# EAGLE design V4-AddOnZigbee-DIL-V02-004 (EAGLE 7.7.0)
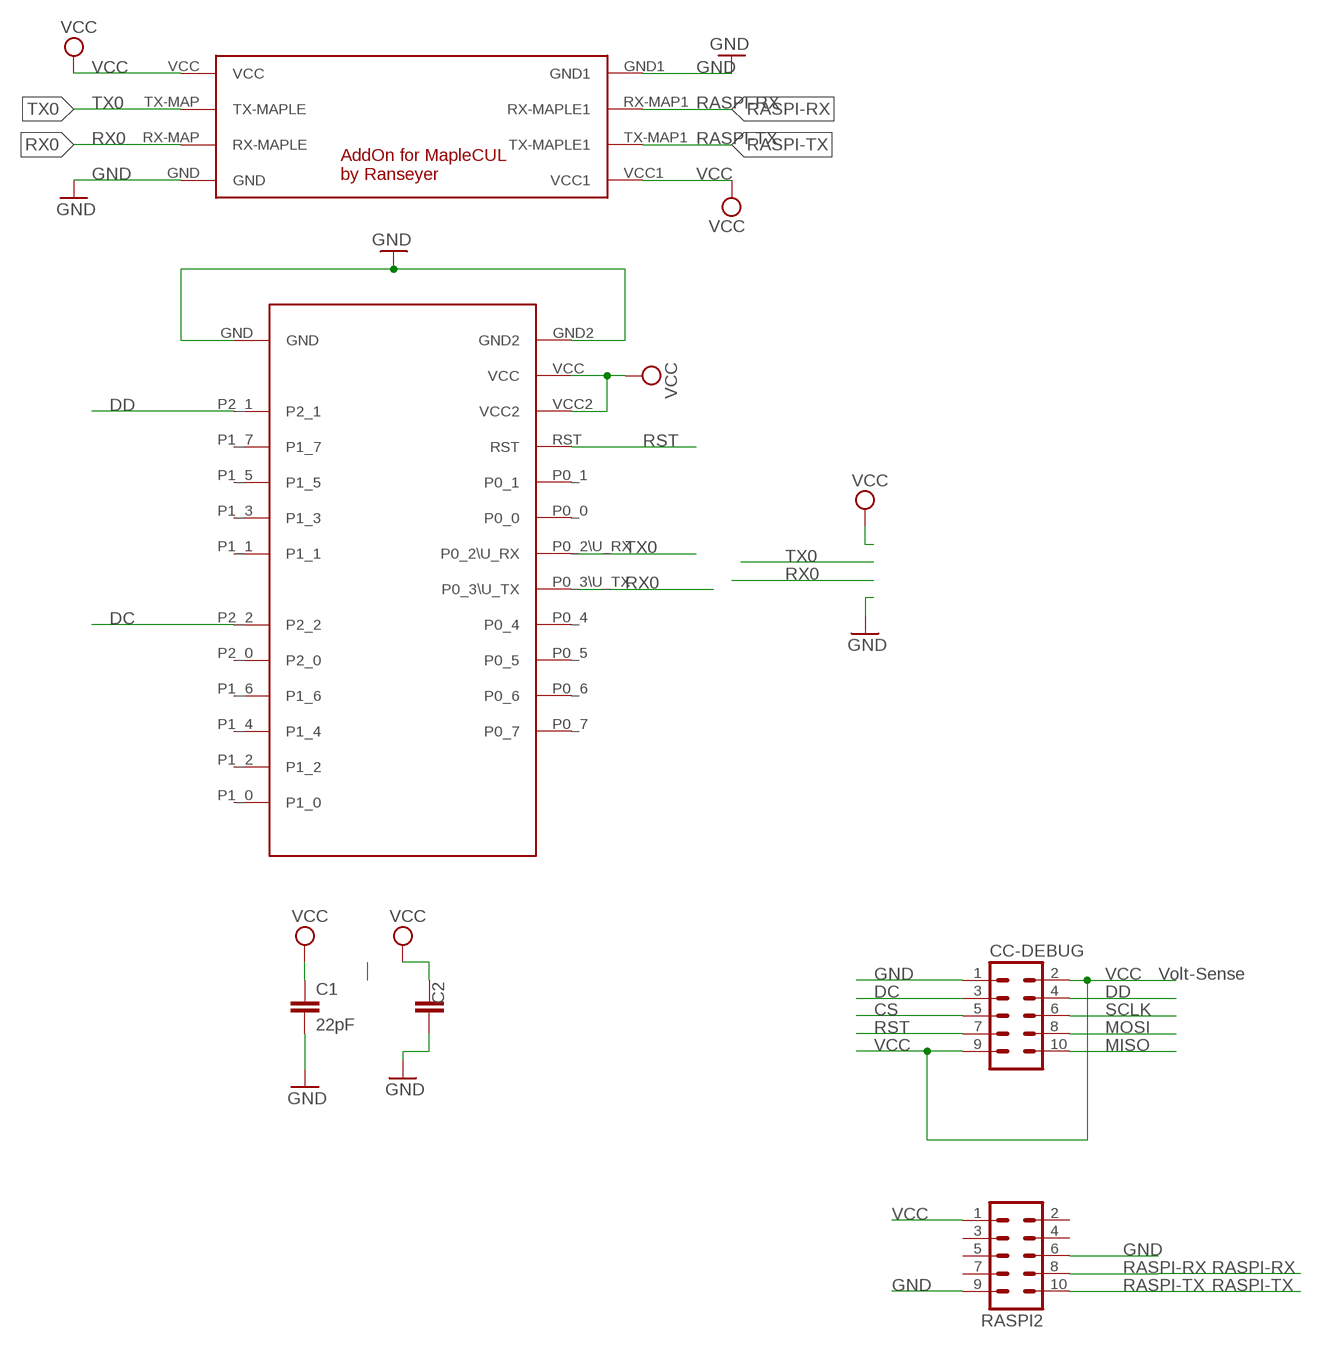
[diagram p0: schematic, sheet 1]

## Parts
C1  22pF  C-EUC0805  [C0805]
C2  C-EUC1812  [C1812]
CC-DEBUG  CONN_05X2SHD_LOCK  [2X5-SHROUDED_LOCK]
RASPI2  MA05-2  [MA05-2]
U$1  MAPLE-CUL-ADDON-V01  [MAPLE-CUL-V01]
U$3  CC2530_MODULE  [CC2530_DIL]

## Nets
CS: CC-DEBUG.5
DC: CC-DEBUG.3 U$3.P2_2
DD: CC-DEBUG.4 U$3.P2_1
GND [PWR]: C1.2 C2.1 CC-DEBUG.1 RASPI2.6 RASPI2.9 U$1.GND U$1.GND1 U$3.GND U$3.GND2
MISO: CC-DEBUG.10
MOSI: CC-DEBUG.8
RASPI-RX: RASPI2.8 U$1.RX-MAP1(RX-MAPLE1)
RASPI-TX: RASPI2.10 U$1.TX-MAP1(TX-MAPLE1)
RST: CC-DEBUG.7 U$3.RST
RX0: U$1.RX-MAP(RX-MAPLE) U$3.P0_3\U_TX
SCLK: CC-DEBUG.6
TX0: U$1.TX-MAP(TX-MAPLE) U$3.P0_2\U_RX
VCC [PWR]: C1.1 C2.2 CC-DEBUG.2 CC-DEBUG.9 RASPI2.1 U$1.VCC U$1.VCC1 U$3.VCC U$3.VCC2
Unconnected: RASPI2.2 RASPI2.3 RASPI2.4 RASPI2.5 RASPI2.7 U$3.P0_0 U$3.P0_1 U$3.P0_4 U$3.P0_5 U$3.P0_6 U$3.P0_7 U$3.P1_0 U$3.P1_1 U$3.P1_2 U$3.P1_3 U$3.P1_4 U$3.P1_5 U$3.P1_6 U$3.P1_7 U$3.P2_0

## Notes on the sheet
- Volt-Sense

## Library data of the parts
C1 C2 = rcl:C-EU: CAPACITOR, European symbol; SPICEPREFIX: C
CC-DEBUG = SparkFun-Connectors:CONN_05X2: Multi connection point. Often used as Generic Header-pin footprint for 0.1 inch spaced/style header connections For AVR SPI programming port, see special device with nice symbol: "AVR_SPI_PROG_5x2.dev" You can populate with any combo of single row headers, but if you'd like an exact match, check these: 2x5 AVR ICSP Male Header <https://www.sparkfun.com/products/778> (PRT-00778) 2x5 Pin Shrouded Header <https://www.sparkfun.com/products/8506> (PRT-08506) On any of the 0.1 inch spaced packages, you can populate with these: Break Away Headers - Straight <https://www.sparkfun.com/products/116> (PRT-00116) Break Away Male Headers - Right Angle <https://www.sparkfun.com/products/553> (PRT-00553) Female Headers <https://www.sparkfun.com/products/115> (PRT-00115) Break Away Headers - Machine Pin <https://www.sparkfun.com/products/117> (PRT-00117) Break Away Female Headers - Swiss Machine Pin <https://www.sparkfun.com/products/743> (PRT-00743) Special note: the shrouded connector mates well with our 5x2 ribbon cables: 2x5 Pin IDC Ribbon Cable <https://www.sparkfun.com/products/8535> (PRT-08535); PROD_ID: CONN-08671; SF_ID: PRT-08506
RASPI2 = con-lstb:MA05-2: PIN HEADER; OC_FARNELL: unknown; OC_NEWARK: unknown
U$1 = Martin-Communication-V4:MAPLE-CUL-ADDON-V01: AddOn for MAPLE-CUL V4.x
U$3 = Martin-Communication-V4:CC2530_MODULE

## Net classes
0 default: width 0.356 mm
1 PWR: width 0.559 mm

## Board
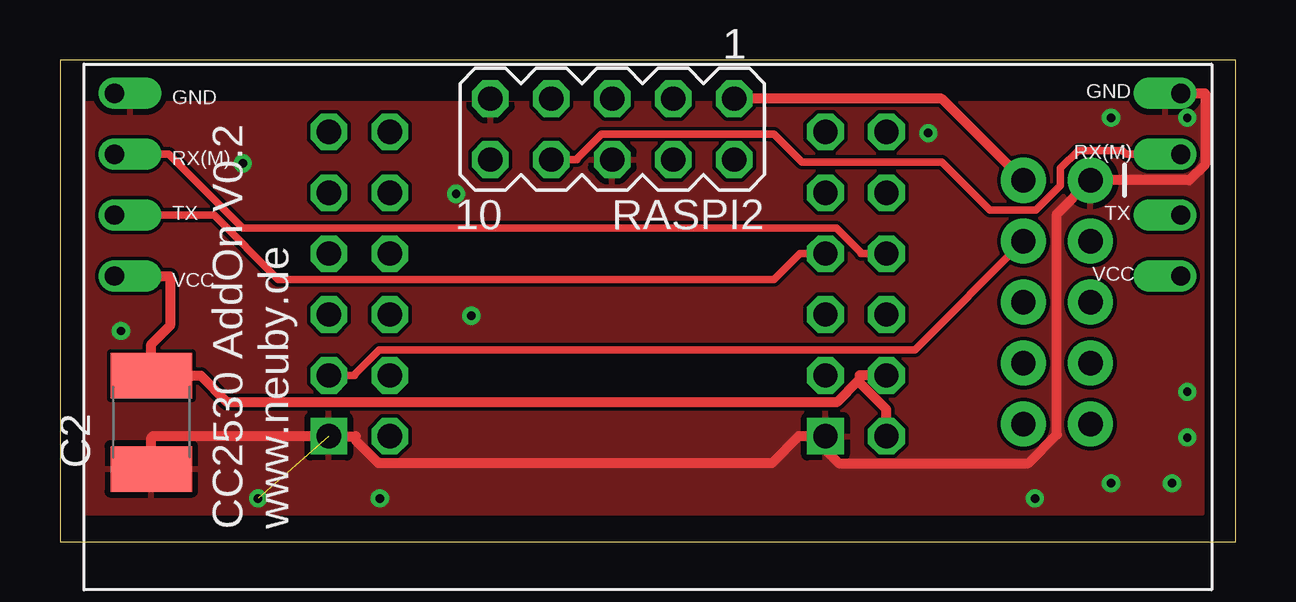
[diagram p1: board, top side]
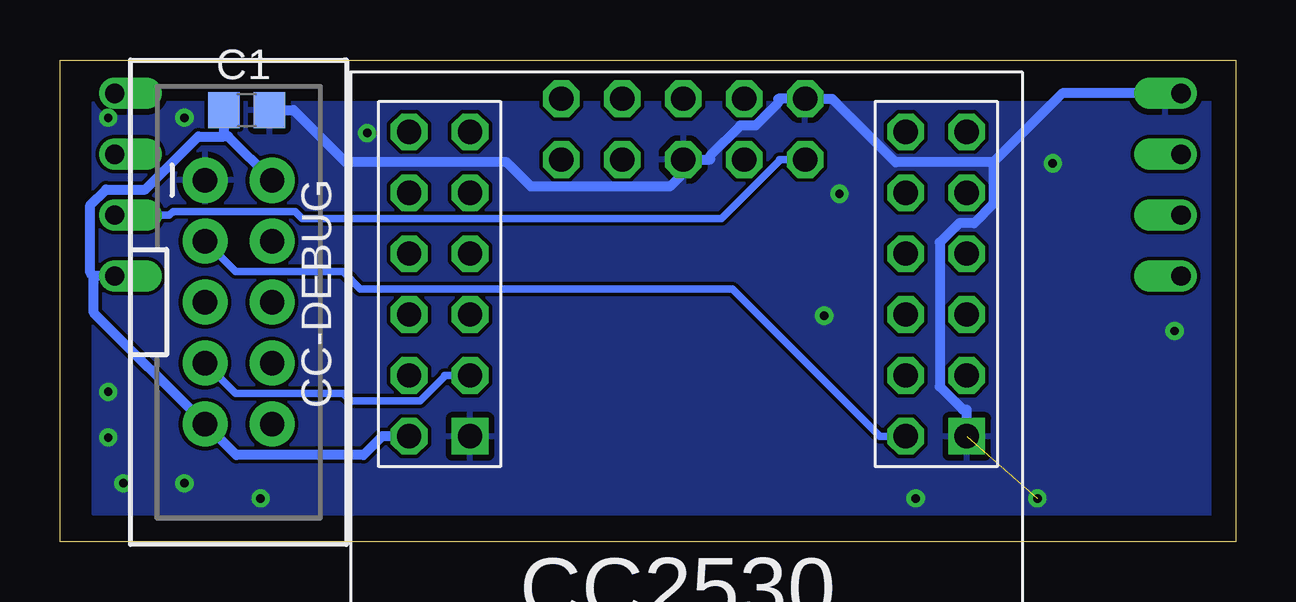
[diagram p2: board, bottom side, seen from below]

Size 49 x 20.09 mm. Coordinates in mm from the lower left corner, seen from the top.
Outline: 0,0 49,0 49,20.09 0,20.09 0,0
Copper layers (1*16): Top 0.035mm / dielectric 1.5mm / Bottom 0.035mm
Design rules "default": minimum track width 6mil, minimum drill 0.35mm, track to track 6mil, track to pad 6mil, pad to pad 6mil, via to via 6mil, smd to smd 6mil, copper to edge 40mil, drill to drill 6mil, minimum pad ring 10mil, minimum via ring 8mil, stop-mask expansion 4mil, vias tented up to drill 0mil, thermal gap 10mil

### Footprints (pad centres in the part's own frame; a part is rotated, then mirrored left to right if it is on the bottom)
C0805 = smd 1.3 x 1.5: 1 -0.95,0; 2 0.95,0
C1812 = smd 1.9 x 3.4: 1 -1.95,0; 2 1.95,0
2X5-SHROUDED_LOCK = drill 1.016 pad 1.88: 1 -1.397,5.08; 2 1.397,5.08; 3 -1.397,2.54; 4 1.397,2.54; 5 -1.397,0; 6 1.397,0; 7 -1.397,-2.54; 8 1.397,-2.54; 9 -1.397,-5.08; 10 1.397,-5.08
MA05-2 = drill 1.016 octagon: 1 -5.08,-1.27; 2 -5.08,1.27; 3 -2.54,-1.27; 4 -2.54,1.27; 5 0,-1.27; 6 0,1.27; 7 2.54,-1.27; 8 2.54,1.27; 9 5.08,-1.27; 10 5.08,1.27
MAPLE-CUL-V01 = drill 0.8 offset: GND 1.27,12.7; GND1 45.72,12.7; RX-MAP 1.27,10.16; RX-MAP1 45.72,10.16; TX-MAP 1.27,7.62; TX-MAP1 45.72,7.62; VCC 1.27,5.08; VCC1 45.72,5.08
CC2530_DIL = drill 1.016 square: GND 2.316,15.19; GND2 23.017,15.19 | drill 1.016 octagon: P0_0 23.017,10.11; P0_1 25.557,10.11; P0_2\U_RX 23.017,7.57; P0_3\U_TX 25.557,7.57; P0_4 23.017,5.03; P0_5 25.557,5.03; P0_6 23.017,2.49; P0_7 25.557,2.49; P1_0 4.856,2.49; P1_1 2.316,2.49; P1_2 4.856,5.03; P1_3 2.316,5.03; P1_4 4.856,7.57; P1_5 2.316,7.57; P1_6 4.856,10.11; P1_7 2.316,10.11; P2_0 4.856,12.65; P2_1 2.316,12.65; P2_2 4.856,15.19; RST 23.017,12.65; VCC 25.557,15.19; VCC2 25.557,12.65

### Placement (x,y rotation side)
C1  41.22,18 0 bottom
C2  3.81,4.99 90 top
CC-DEBUG  41.55,9.99 0 bottom
RASPI2  23.02,17.21 180 top
U$1  1,6 0 top
U$3  8.89,19.59 180 bottom

### Tracks (layer width: path | path; a pad name or v marks a point on that pad's centre or on a via)
DC
  Bottom 0.305: U$3.P2_2 14.81,4.4 20.96,10.55 36.49,10.55 37.21,11.27 41.68,11.27 CC-DEBUG.3
DD
  Top 0.305: U$3.P2_1 12.27,6.94 12.27,6.98 13.3,8.01 35.63,8.01 CC-DEBUG.4
GND  (via drill 0.35)  (1 unrouted)
  Top 0.406: 31.35,4.4 32.47,3.28 40.36,3.28 41.55,4.48 41.55,13.68 CC-DEBUG.1 47.06,15.07 47.73,15.74 47.73,18.7 U$1.GND1 | 31.35,4.4 30.79,4.4 29.67,3.28 13.28,3.28 12.32,4.23 12.32,4.4 U$3.GND 3.87,4.4 3.81,4.34 C2.1 | U$3.GND2 31.35,4.4
  Bottom 0.406: 10.09,15.83 14.17,15.83 16.82,18.48 RASPI2.9 19.06,18.48 19.06,18.31 20.01,17.36 20.64,17.36 21.9,16.1 21.9,15.94 22.46,15.94 | U$1.GND 7.22,18.7 10.09,15.83 | 10.09,15.83 10.09,14.1 10.89,13.29 11.52,13.29 12.33,12.48 12.33,6.47 11.37,5.52 11.21,5.52 U$3.GND | C1.2 39.26,18 37.09,15.83 30.38,15.83 29.37,14.82 23.58,14.82 22.46,15.94 | RASPI2.6 22.46,15.94
  other vias: 8.26,1.81 2.54,8.79 7.62,15.78 16.51,14.51 17.14,9.43 13.34,1.81 46.35,2.45 43.81,2.45 40.64,1.81 46.99,4.35 46.99,6.26 46.99,17.68 43.81,17.68 36.2,17.05
  pour Top: 0.64,18.32 47.62,18.32 47.62,1.17 0.64,1.17
  pour Bottom: 0.64,18.32 46.99,18.32 47.62,18.32 47.62,1.17 0.64,1.17
RASPI-RX
  Top 0.305: RASPI2.8 21.55,15.94 21.55,15.98 22.58,17.01 29.75,17.01 30.93,15.83 36.77,15.83 38.77,13.83 40.67,13.83 41.71,14.86 41.71,15.59 42.44,16.32 44.29,16.32 44.45,16.16 U$1.RX-MAP1
RASPI-TX
  Bottom 0.305: RASPI2.10 19.01,15.94 19.01,15.9 21.42,13.49 38.91,13.49 39.2,13.78 44.29,13.78 44.45,13.62 U$1.TX-MAP1
RST
  Bottom 0.305: U$3.RST 32.97,6.94 32.97,6.9 34,5.87 36.89,5.87 37.21,6.19 41.68,6.19 CC-DEBUG.7
RX0
  Top 0.305: U$1.RX-MAP 4.54,16.16 7.61,13.09 32.35,13.09 33.38,12.06 33.38,12.02 U$3.P0_3\U_TX
TX0
  Top 0.305: U$3.P0_2\U_RX 30.84,12.02 29.77,10.95 9.1,10.95 6.43,13.62 U$1.TX-MAP
VCC
  Top 0.406: CC-DEBUG.2 36.75,18.48 RASPI2.1 | 33.26,6.71 32.38,5.82 6.98,5.82 5.87,6.94 C2.2 3.81,8.24 4.59,9.02 4.59,11.08 U$1.VCC | 33.26,6.71 33.33,6.77 33.33,6.94 U$3.VCC2 | 33.26,6.71 34.45,5.52 U$3.VCC
  Bottom 0.406: CC-DEBUG.2 41.98,16.9 42.17,16.9 | 47.59,11.08 47.59,9.55 CC-DEBUG.9 41.66,3.62 36.35,3.62 35.56,4.4 U$3.VCC | C1.1 42.17,16.9 | 47.59,11.08 47.73,11.22 47.73,14.04 47.08,14.69 45.44,14.69 43.24,16.9 42.17,16.9 | U$1.VCC1 47.59,11.08

### Text on the board
tPlace: CC2530 AddOn V0.2 / www.neuby.de